# Altium schematic sheet MCUModule.SchDoc
size 420 x 297 mm; Address1: Address1; Address2: Address2; Address3: Address3; Address4: Address4; DocumentNumber: АБВГ.123456.001 Э3; SheetNumber: 1; Scale: 1:1; DocumentType: Схема электрическая принципиальная; FirstReferrence: АБВГ.123456.001
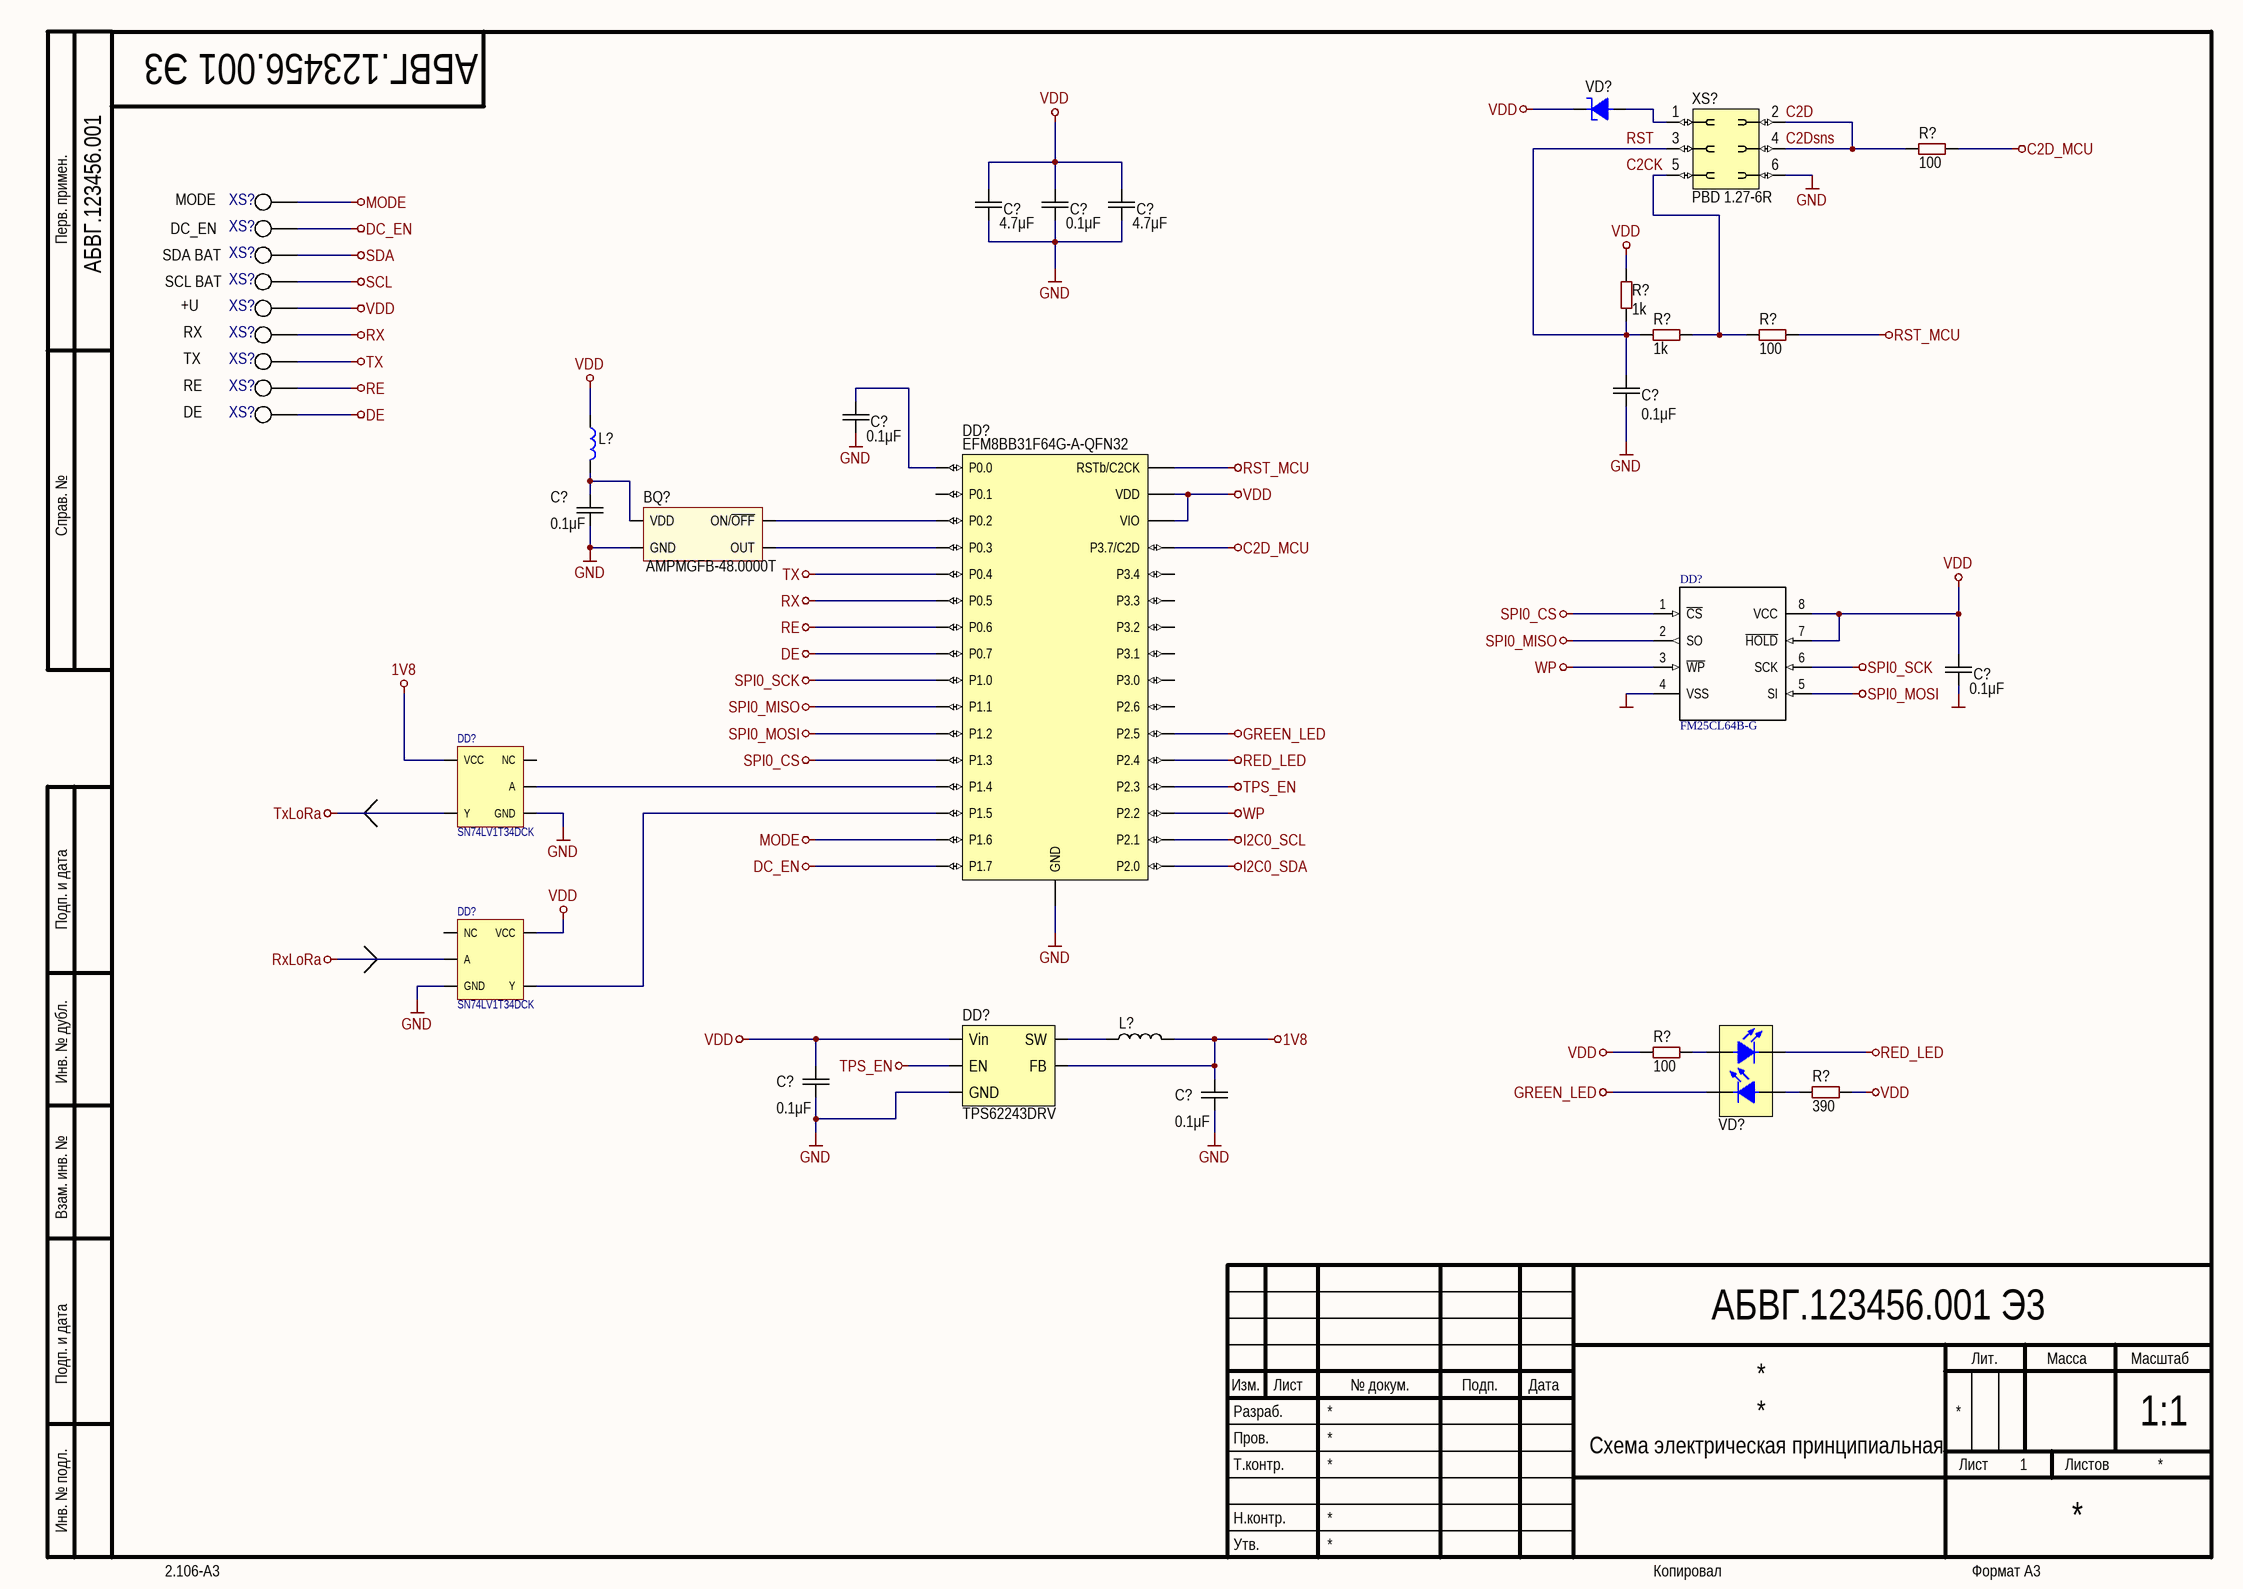
[diagram p0: MCUModule.SchDoc]

## Parts
(Parts that share a designator on the sheet are numbered #1, #2 ... from top to bottom, then left to right.)
BQ?  AMPMGFB-48.0000T  [AMPMGFB(1.6x1.2)]
C?#1  value 4.7μF  [CAP: 0603]
C?#2  value 0.1μF  [CAP: 0603]
C?#3  value 4.7μF  [CAP: 0603]
C?#4  value 0.1μF  [CAP: 0603]
C?#5  value 0.1μF  [CAP: 0603]
C?#6  value 0.1μF  [CAP: 0603]
C?#7  value 0.1μF  [CAP: 0603]
C?#8  value 0.1μF  [CAP: 0603]
C?#9  value 0.1μF  [CAP: 0603]
DD?#1  EFM8BB31F64G-A-QFN32  [32-QFN(4x4)]
DD?#2  FM25CL64B-G  [SO-8_N]
DD?#3  SN74LV1T34DCK  [SC70-5]
DD?#4  SN74LV1T34DCK  [SC70-5]
DD?#5  TPS62243DRV  [SOT23-5]
L?#1  BLM18AG102SN1D  [IND: 0603]  (value not drawn)
L?#2  VLF302515MT  [VLF302515MT]  (value not drawn)
R?#1  value 100  [RES: 0603]
R?#2  value 1k  [RES: 0603]
R?#3  value 1k  [RES: 0603]
R?#4  value 100  [RES: 0603]
R?#5  value 100  [RES: 0603]
R?#6  value 390  [RES: 0603]
VD?#1  (no value)  [DIODE: SOD523]
VD?#2  Dual LED  [KAA-3528]  (value not drawn)
XS?#1  PBD 1.27-6R  [CON: PBD1.27-6]
XS?#2  Testpoint_HS1mm  [TestPoint(1mm_HS)]  (value not drawn)
XS?#3  Testpoint_HS1mm  [TestPoint(1mm_HS)]  (value not drawn)
XS?#4  Testpoint_HS1mm  [TestPoint(1mm_HS)]  (value not drawn)
XS?#5  Testpoint_HS1mm  [TestPoint(1mm_HS)]  (value not drawn)
XS?#6  Testpoint_HS1mm  [TestPoint(1mm_HS)]  (value not drawn)
XS?#7  Testpoint_HS1mm  [TestPoint(1mm_HS)]  (value not drawn)
XS?#8  Testpoint_HS1mm  [TestPoint(1mm_HS)]  (value not drawn)
XS?#9  Testpoint_HS1mm  [TestPoint(1mm_HS)]  (value not drawn)
XS?#10  Testpoint_HS1mm  [TestPoint(1mm_HS)]  (value not drawn)

## Nets
1V8: C?#9.2 DD?#3.5(VCC) DD?#5.4(FB) L?#2.2
C2D_MCU: DD?#1.5(P3.7/C2D) R?#1.1
DC_EN: DD?#1.18(P1.7) XS?#3.1
DE: DD?#1.26(P0.7) XS?#10.1
GND: BQ?.2(GND) C?#1.1 C?#2.1 C?#3.1 C?#4.1 C?#5.1 C?#6.1 C?#7.1 C?#8.1 C?#9.1 DD?#1.0(GND) DD?#2.4(VSS) DD?#3.3(GND) DD?#4.3(GND) DD?#5.2(GND) XS?#1.6
GREEN_LED: DD?#1.12(P2.5) VD?#2.3(C)
I2C0_SCL: DD?#1.16(P2.1)
I2C0_SDA: DD?#1.17(P2.0)
MODE: DD?#1.19(P1.6) XS?#2.1
RE: DD?#1.27(P0.6) XS?#9.1
RED_LED: DD?#1.13(P2.4) VD?#2.1(C)
RST_MCU: DD?#1.4(RSTb/C2CK) R?#4.2
RX: DD?#1.28(P0.5) XS?#7.1
RxLoRa: DD?#4.2(A)
SCL: XS?#5.1
SDA: XS?#4.1
SPI0_CS: DD?#1.22(P1.3) DD?#2.1(~{CS})
SPI0_MISO: DD?#1.24(P1.1) DD?#2.2(SO)
SPI0_MOSI: DD?#1.23(P1.2) DD?#2.5(SI)
SPI0_SCK: DD?#1.25(P1.0) DD?#2.6(SCK)
TPS_EN: DD?#1.14(P2.3) DD?#5.3(EN)
TX: DD?#1.29(P0.4) XS?#8.1
TxLoRa: DD?#3.4(Y)
VDD: C?#1.2 C?#2.2 C?#3.2 C?#7.2 C?#8.2 DD?#1.2(VIO) DD?#1.3(VDD) DD?#2.7(~{HOLD}) DD?#2.8(VCC) DD?#4.5(VCC) DD?#5.1(Vin) L?#1.1 R?#2.1 R?#5.1 R?#6.2 VD?#1.2 XS?#6.1
WP: DD?#1.15(P2.2) DD?#2.3(~{WP})
C2D: R?#1.2 XS?#1.2 XS?#1.4  [also labelled C2Dsns]
RST: C?#4.2 R?#2.2 R?#3.1 XS?#1.3
NetBQ?_1: BQ?.1(ON/~{OFF}) DD?#1.31(P0.2)
NetBQ?_3: BQ?.3(OUT) DD?#1.30(P0.3)
NetBQ?_4: BQ?.4(VDD) C?#6.2 L?#1.2
NetC?#5_2: C?#5.2 DD?#1.1(P0.0)
NetDD?#1_20: DD?#1.20(P1.5) DD?#4.4(Y)
NetDD?#1_21: DD?#1.21(P1.4) DD?#3.2(A)
NetDD?#5_5: DD?#5.5(SW) L?#2.1
NetR?#3_2: R?#3.2 R?#4.1 XS?#1.5
NetR?#5_2: R?#5.2 VD?#2.2(A)
NetR?#6_1: R?#6.1 VD?#2.4(A)
NetVD?#1_1: VD?#1.1 XS?#1.1

Not connected (* = marked no-connect by the designer): DD?#1 6(P3.4) 7(P3.3) 8(P3.2) 9(P3.1) 10(P3.0) 11(P2.6) 32(P0.1); DD?#3 1(NC); DD?#4 1(NC)

## Notes on the sheet
- (near XS?#4) SDA BAT
- DC_EN
- MODE
- (near XS?#5) SCL BAT
- +U
- RX
- TX
- RE
- DE
- Labels drawn without touching a wire or pin: C2CK
- Перв. примен.
- Справ. №
- Подп. и дата
- Инв. № дубл.
- Взам. инв. №
- Разраб.
- Изм.
- Лист
- № докум.
- Подп.
- Дата
- Лит.
- Масса
- Масштаб
- Пров.
- Т.контр.
- Листов
- Инв. № подл.
- Утв.
- Н.контр.
- 2.106-A3
- Копировал
- Формат А3

## Library data of the parts
C?#1 C?#3 = Ceramic_0603: Manufacturer: Yageo; PartNumber: CC0603KRX7R7BB104; ValueManufacturerPartNumber: Ceramic capacitor, 4.7μF, X7R, ±10%, 16V, 0603, -55...+125°C; TypeCapacitor: Ceramic capacitor; Tolerance: ±10%; TypeDielectric: X7R; Voltage: 16V; Package: 0603; HelpURL: https://www.digikey.com/product-detail/en/yageo/CC0603KRX7R7BB104/311-1088-1-ND/302998; Temperature: -55...+125°C
C?#2 C?#4-C?#9 = Ceramic_0603: Manufacturer: Yageo; PartNumber: CC0603KRX7R7BB104; ValueManufacturerPartNumber: Ceramic capacitor, 0.1μF, X7R, ±10%, 16V, 0603, -55...+125°C; TypeCapacitor: Ceramic capacitor; Tolerance: ±10%; TypeDielectric: X7R; Voltage: 16V; Package: 0603; HelpURL: https://www.digikey.com/product-detail/en/yageo/CC0603KRX7R7BB104/311-1088-1-ND/302998; Temperature: -55...+125°C
DD?#1 = EFM8BB31F64G-A-QFN32: 8051 MCU Core
DD?#2 = FM25CL64B-G: Микросхема; ReplacementPart1Manufacturer: ISSI; ReplacementPart1PartNumber: IS25C08-2ZLI-TR; ComponentLink1Description: Manufacturer Link; ComponentLink1URL: http://www.microchip.com; ComponentLink2Description: Datasheet; ComponentLink3Description: Packaging Specification; PartNumber: FM25CL64B-G; Manufacturer: FM25CL64B-G
DD?#3 DD?#4 = SN74LV1T34DCK: Single Buffer; ComponentLink1Description: Datasheet; ComponentLink1URL: https://www.ti.com/lit/ds/symlink/sn74lv1t34.pdf?ts=1607003293244&ref_url=https%253A%252F%252Fwww.ti.com%252Fproduct%252FSN74LV1T34
DD?#5 = TPS62243DRV: Step-down converter 300mA
L?#1 = BLM18AG102SN1D: 100MHz 1K
R?#1 R?#4 R?#5 = Resistor_0603: Manufacturer: Yageo; PartNumber: RC0603JR-07100RL; ValueManufacturerPartNumber: Resistor film, 100, ±5%, 0603, 0.1W, -55...+125°C; TypeResistor: Resistor film; Power: 0.1W; Tolerance: ±5%; Package: 0603; HelpURL: https://www.digikey.com/product-detail/en/yageo/RC0603JR-07100RL/311-100GRCT-ND/729644; Temperature: -55...+125°C
R?#2 R?#3 = Resistor_0603: Manufacturer: Yageo; PartNumber: RC0603JR-07100RL; ValueManufacturerPartNumber: Resistor film, 1k, ±5%, 0603, 0.1W, -55...+125°C; TypeResistor: Resistor film; Power: 0.1W; Tolerance: ±5%; Package: 0603; HelpURL: https://www.digikey.com/product-detail/en/yageo/RC0603JR-07100RL/311-100GRCT-ND/729644; Temperature: -55...+125°C
R?#6 = Resistor_0603: Manufacturer: Yageo; PartNumber: RC0603JR-07100RL; ValueManufacturerPartNumber: Resistor film, 390, ±5%, 0603, 0.1W, -55...+125°C; TypeResistor: Resistor film; Power: 0.1W; Tolerance: ±5%; Package: 0603; HelpURL: https://www.digikey.com/product-detail/en/yageo/RC0603JR-07100RL/311-100GRCT-ND/729644; Temperature: -55...+125°C
VD?#1 = Schottky_single: Manufacturer: Diodes Incorporated; ValueManufacturerPartNumber: Schottky diode, 80V, 500mA, 1V, 15pF, SOD-123, -55...+150°C; PartNumber: BAT54XV2; TypeDiode: Schottky diode; Voltage: 80V; Current: 500mA; VoltageDrop: 1V; RecoveryTime: 15pF; Package: SOD-123; HelpURL: https://www.digikey.com/product-detail/en/diodes-incorporated/MBR0580S1-7/MBR0580S1-7DICT-ND/5080371; Temperature: -55...+150°C
VD?#2 = Dual LED: 2-1 RED, 4-3 GREEN; ComponentLink1Description: Datasheet; ComponentLink1URL: https://static.chipdip.ru/lib/935/DOC011935168.pdf